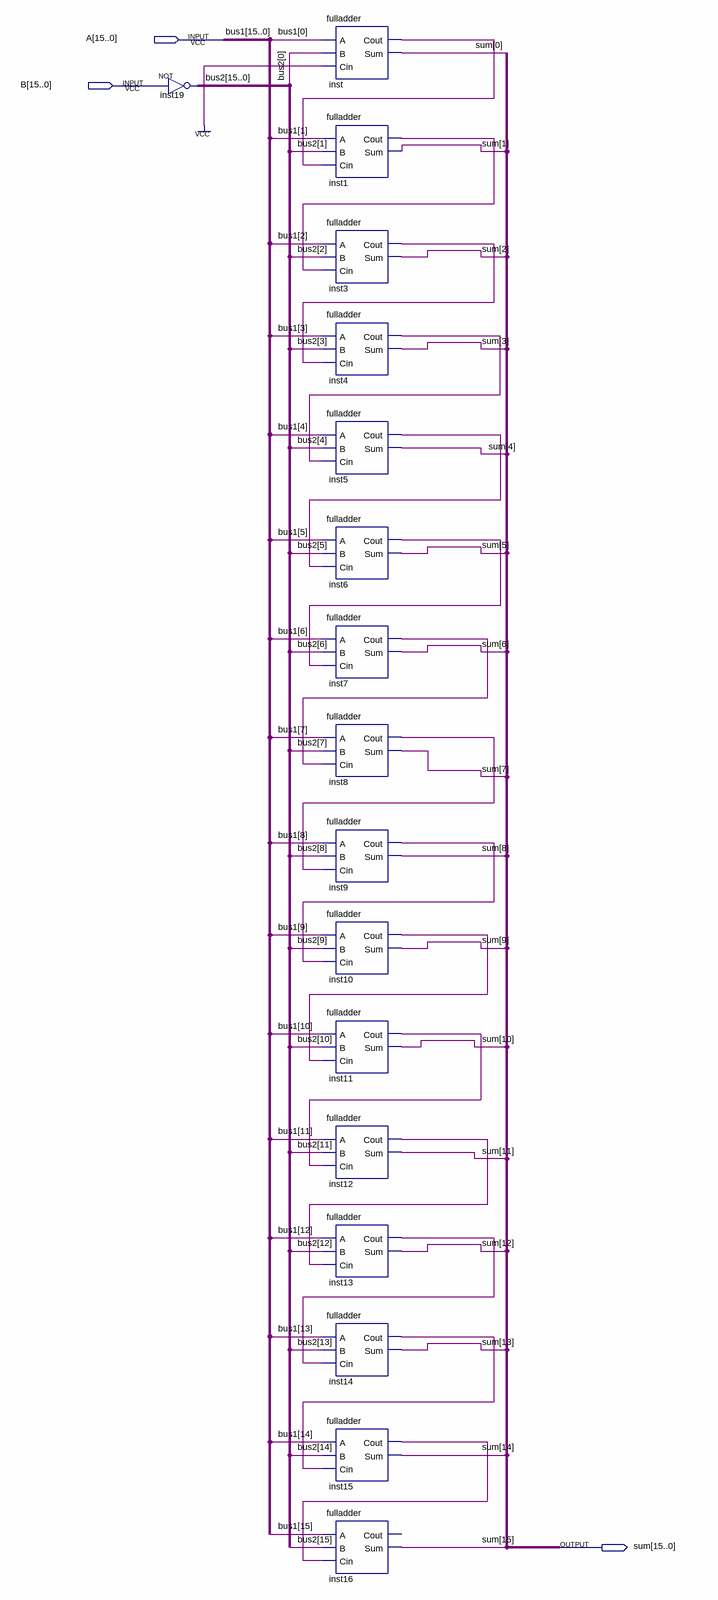
[diagram p0: schematic sheet]
// Quartus schematic subeer16bit.bdf as structural Verilog: 17 symbols, 3 pins
module subeer16bit (
  input  [15:0] A,
  input  [15:0] B,
  output [15:0] sum
);

  wire inst1_cout, inst3_cout, inst4_cout, inst5_cout, inst6_cout, inst7_cout, inst8_cout, inst9_cout,
       inst10_cout, inst11_cout, inst12_cout, inst13_cout, inst14_cout, inst15_cout, inst_cout;
  wire [15:0] bus2;

  assign bus2 = ~B;  // NOT inst19, 16 bits wide
  fulladder inst (.A(A[0]), .B(bus2[0]), .Cin(1'b1), .Cout(inst_cout), .Sum(sum[0]));
  fulladder inst1 (.A(A[1]), .B(bus2[1]), .Cin(inst_cout), .Cout(inst1_cout), .Sum(sum[1]));
  fulladder inst3 (.A(A[2]), .B(bus2[2]), .Cin(inst1_cout), .Cout(inst3_cout), .Sum(sum[2]));
  fulladder inst4 (.A(A[3]), .B(bus2[3]), .Cin(inst3_cout), .Cout(inst4_cout), .Sum(sum[3]));
  fulladder inst5 (.A(A[4]), .B(bus2[4]), .Cin(inst4_cout), .Cout(inst5_cout), .Sum(sum[4]));
  fulladder inst6 (.A(A[5]), .B(bus2[5]), .Cin(inst5_cout), .Cout(inst6_cout), .Sum(sum[5]));
  fulladder inst7 (.A(A[6]), .B(bus2[6]), .Cin(inst6_cout), .Cout(inst7_cout), .Sum(sum[6]));
  fulladder inst8 (.A(A[7]), .B(bus2[7]), .Cin(inst7_cout), .Cout(inst8_cout), .Sum(sum[7]));
  fulladder inst9 (.A(A[8]), .B(bus2[8]), .Cin(inst8_cout), .Cout(inst9_cout), .Sum(sum[8]));
  fulladder inst10 (.A(A[9]), .B(bus2[9]), .Cin(inst9_cout), .Cout(inst10_cout), .Sum(sum[9]));
  fulladder inst11 (.A(A[10]), .B(bus2[10]), .Cin(inst10_cout), .Cout(inst11_cout), .Sum(sum[10]));
  fulladder inst12 (.A(A[11]), .B(bus2[11]), .Cin(inst11_cout), .Cout(inst12_cout), .Sum(sum[11]));
  fulladder inst13 (.A(A[12]), .B(bus2[12]), .Cin(inst12_cout), .Cout(inst13_cout), .Sum(sum[12]));
  fulladder inst14 (.A(A[13]), .B(bus2[13]), .Cin(inst13_cout), .Cout(inst14_cout), .Sum(sum[13]));
  fulladder inst15 (.A(A[14]), .B(bus2[14]), .Cin(inst14_cout), .Cout(inst15_cout), .Sum(sum[14]));
  fulladder inst16 (.A(A[15]), .B(bus2[15]), .Cin(inst15_cout), .Sum(sum[15]));  // open: Cout

  // Other names for the same wires on the sheet: bus1[15:0] = A
endmodule
